# EAGLE design Sozu (EAGLE 9.4.2)
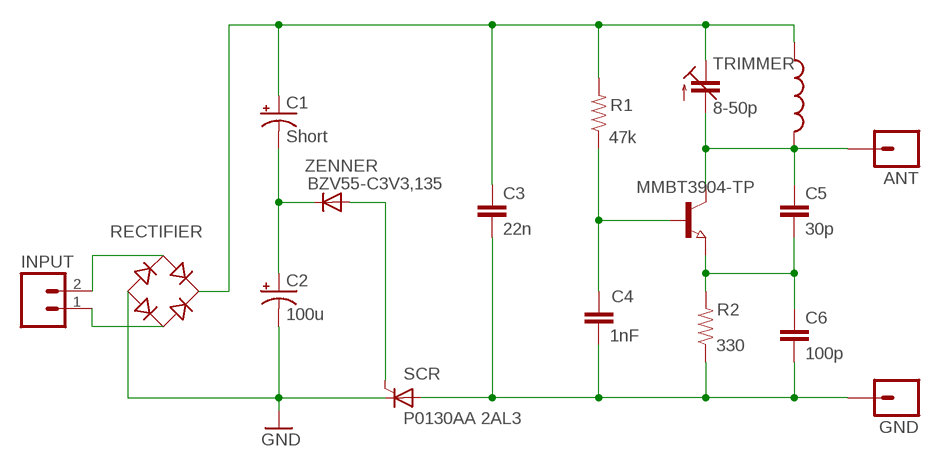
[diagram p0: schematic, sheet 1]

## Parts
ANT  M01PTH  [1X01]
C1  Short  ENERGY_CAP  [ENERGY_CAP_2312]
C2  100u  ENERGY_CAP  [ENERGY_CAP_2312]
C3  22n  CAP0603-CAP  [0603-CAP]
C4  1nF  CAP0603-CAP  [0603-CAP]
C5  30p  CAP0603-CAP  [0603-CAP]
C6  100p  CAP0603-CAP  [0603-CAP]
GND  M01PTH  [1X01]
INPUT  M02PTH  [1X02]
Q1  MMBT3904-TP  NPN-TRANSISTOR_SOT23  [SOT23]
R1  47k  RESISTOR0603-RES  [0603-RES]
R2  330  RESISTOR0603-RES  [0603-RES]
RECTIFIER  SOZU_RECTIFIER  [RFTAG_RECTIFIER]
SCR  P0130AA 2AL3  BT169  [TO92-2]
TRIMMER  8-50p  SOZU_TRIMMER_CAP  [SPARKFUN-CAPACITORS_GRM43D]
U$2  SOZU_INDUCTOR  [SOZU_INDUCTOR]
ZENNER  BZV55-C3V3,135  DIODESOD-123  [SOD-123]

## Nets
COLLECTER: ANT.1 C5.1 Q1.3(C) TRIMMER.A U$2.2
GND: C2.2(-) RECTIFIER.P$4(-) SCR.C
N$1: INPUT.2 RECTIFIER.P$1(AC1)
N$2: C1.2(-) C2.1(+) ZENNER.C
N$3: SCR.G ZENNER.A
N$5: INPUT.1 RECTIFIER.P$2(AC2)
N$8: C5.2 C6.1 Q1.2(E) R2.2
N$9: C4.1 Q1.1(B) R1.1
V_GND: C3.2 C4.2 C6.2 GND.1 R2.1 SCR.A
VDC: C1.1(+) C3.1 R1.2 RECTIFIER.P$3(+) TRIMMER.C(E) U$2.1

## Library data of the parts
ANT GND = SparkFun-Connectors:M01: Header 1 Standard 1-pin 0.1" header. Use with straight break away headers (SKU : PRT-00116), right angle break away headers (PRT-00553), swiss pins (PRT-00743), machine pins (PRT-00117), and female headers (PRT-00115).
C1 C2 = rftag:ENERGY_CAP
C3-C6 = SparkFun-Passives:CAP: Capacitor Standard 0603 ceramic capacitor, and 0.1" leaded capacitor.
INPUT = SparkFun-Connectors:M02: Standard 2-pin 0.1" header. Use with - straight break away headers ( PRT-00116) - right angle break away headers (PRT-00553) - swiss pins (PRT-00743) - machine pins (PRT-00117) - female headers (PRT-00115) Molex polarized connector foot print use with: PRT-08233 with associated crimp pins and housings. 2.54_SCREWTERM for use with PRT-10571. 3.5mm Screw Terminal footprints for PRT-08084 5mm Screw Terminal footprints for use with PRT-08432
Q1 = semicon-smd-ipc:NPN-TRANSISTOR_: NPN TRANSISTOR
R1 R2 = SparkFun-Passives:RESISTOR: Resistor Basic schematic elements and footprints for 0603, 1206, and PTH resistors.
RECTIFIER = Sozu_1:SOZU_RECTIFIER
SCR = triac:BT169: THYRISTOR
TRIMMER = Sozu_1:SOZU_TRIMMER_CAP
U$2 = Sozu_1:SOZU_INDUCTOR
ZENNER = adafruit:DIODE: Diode SMADIODE - SMA Surface Mount Package 20V 1A Schottky Diode Digikey: 641-1014-6-ND DO-1N4148 - Through Hole Small Current Diode SOD-123 20V 1 A (.5mV Vf) Schottky Diode - Digikey: MBRX120TPMSCT-ND SOD-323 10V 570mA (.38mV Vf, 3ns) Schottky Diode - Digikey: ZLLS410CT-ND SOD-523 30V 30mA Schottky Diode (RB751S-40TE61) - Digikey: RB751S-40TE61CT-ND SOT23-R/W - SOT23 Package (R = Solder Paste/Reflow Ovens, W = Hand-Soldering) BAT54Film 40V 300mA - Digikey: 497-7162-1-ND

## Board
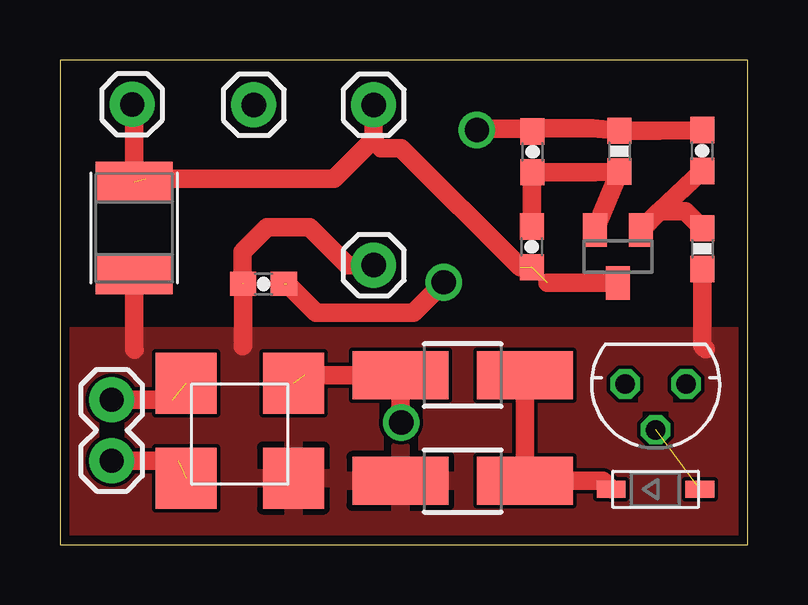
[diagram p1: board, top side]
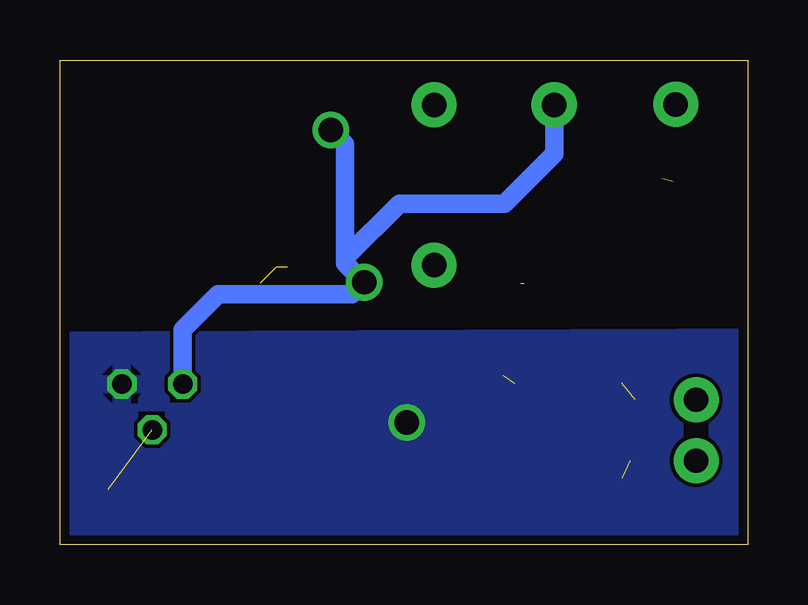
[diagram p2: board, bottom side, seen from below]

Size 28.68 x 20.2 mm. Coordinates in mm from the lower left corner, seen from the top.
Outline: 0,0 28.68,0 28.68,20.2 0,20.2 0,0
Copper layers (1*16): Top 0.0356mm / dielectric 1.5011mm / Bottom 0.0356mm
Design rules "oshpark-2layer": minimum track width 6mil, minimum drill 13mil, track to track 6mil, track to pad 6mil, pad to pad 6mil, via to via 6mil, smd to smd 6mil, copper to edge 15mil, drill to drill 6mil, minimum pad ring 7mil, minimum via ring 7mil, stop-mask expansion 2.5mil, vias tented up to drill 0mil, thermal gap 10mil

### Footprints (pad centres in the part's own frame; a part is rotated, then mirrored left to right if it is on the bottom)
1X01 = drill 1.016 pad 1.88: 1 0,0
ENERGY_CAP_2312 = smd 4 x 2: 1 -2.6,0; 2 2.6,0
0603-CAP = smd 1.1 x 1: 1 -0.85,0; 2 0.85,0
1X02 = drill 1.016 pad 1.88: 1 0,0; 2 2.54,0
SOT23 = smd 1 x 1.4: 1 -0.95,-1.1; 2 0.95,-1.1; 3 0,1.1
0603-RES = smd 1.1 x 1: 1 -0.85,0; 2 0.85,0
RFTAG_RECTIFIER = smd 2.54 x 2.54: P$1 -2.238,1.984; P$2 -2.238,-1.968; P$3 2.238,-1.968; P$4 2.238,1.984
TO92-2 = drill 0.813 octagon: A 1.27,0; C -1.27,0; G 0,1.905
SPARKFUN-CAPACITORS_GRM43D = smd 1.65 x 3.2: A 1.927,0; C -1.927,0
SOZU_INDUCTOR = drill 1.016 pad 1.88: 1 0,3.302; 2 0,-3.378
SOD-123 = smd 1.2 x 0.7: A 1.85,0; C -1.85,0

### Placement (x,y rotation side)
ANT  3.01,18.35 0 top
C1  16.79,2.66 0 top
C2  16.79,7.07 180 top
C3  8.49,10.87 0 top
C4  26.77,16.42 90 top
C5  19.67,12.41 90 top
C6  19.7,16.37 90 top
GND  8.08,18.33 0 top
INPUT  2.16,3.5 90 top
Q1  23.26,12.01 180 top
R1  26.78,12.34 270 top
R2  23.33,16.4 270 top
RECTIFIER  7.49,4.74 0 top
SCR  24.83,6.7 180 top
TRIMMER  3.1,13.2 90 top
U$2  13.08,14.95 180 top
ZENNER  24.83,2.31 0 top

### Tracks (layer width: path | path; a pad name or v marks a point on that pad's centre or on a via)
COLLECTER  (3 unrouted)
  Top 0.762: Q1.3 20.32,10.91 | 3.17,18.19 ANT.1 3.1,18.26 TRIMMER.A | 13.05,16.87 11.43,15.26 3.58,15.26 | 19.19,11.56 14.22,16.53 13.39,16.53 13.05,16.87 | 13.05,16.87 13.08,16.91 U$2.2
GND  (via drill 1.02)  (1 unrouted)
  Top 0.762: 10.21,7.07 C2.2 14.19,6.08 v14.22,5.1
  pour Bottom: -1.55,8.64 29.69,8.5 29.72,-1.98 -1.53,-1.84
N$1  (1 unrouted)
  Top 0.762: INPUT.2 4.7,6.04
N$2
  Top 0.762: C2.1 C1.2 22.63,2.66 ZENNER.C
N$3  (1 unrouted)
N$5  (1 unrouted)
  Top 0.762: INPUT.1 4.92,3.5
N$8
  Top 0.762: C5.2 19.67,15.49 C6.1 22.28,15.52 R2.2 Q1.2 | Q1.2
N$9
  Top 0.762: C4.1 24.99,13.89 | 24.99,13.89 Q1.1 | 24.99,13.89 26.08,13.89 R1.1
V_GND  (via drill 1.02)  (1 unrouted)
  Top 0.762: C6.2 19.7,17.36 19.74,17.36 | 19.74,17.36 19.74,17.34 17.38,17.34 v17.38,17.29 | 19.74,17.36 22.21,17.36 R2.1 24.97,17.25 C4.2 | 15.84,10.77 v16,10.94 | 15.95,10.99 v16,10.94 | 9.47,10.87 10.67,9.67 14.73,9.67 v16,10.94
  Bottom 0.762: v17.38,17.29 16.79,16.69 16.79,11.95 | 16.79,11.95 16.79,11.73 v16,10.94 16.51,10.43 22.1,10.43 23.56,8.96 SCR.A | GND.1 8.08,16.3 10.16,14.21 14.53,14.21 16.79,11.95
VDC  (1 unrouted)
  Top 0.762: 7.62,10.88 7.62,12.21 8.64,13.22 10.41,13.22 11.99,11.65 U$2.1 | R1.2 26.78,8.28 26.92,8.14 | TRIMMER.C 3.1,8.14 3.12,8.12 | C3.1 7.64,8.29 7.62,8.27
  pour Top: -1.52,8.68 29.46,8.68 29.46,-1.25 -1.52,-1.25